# EAGLE design main (EAGLE 9.0.1)
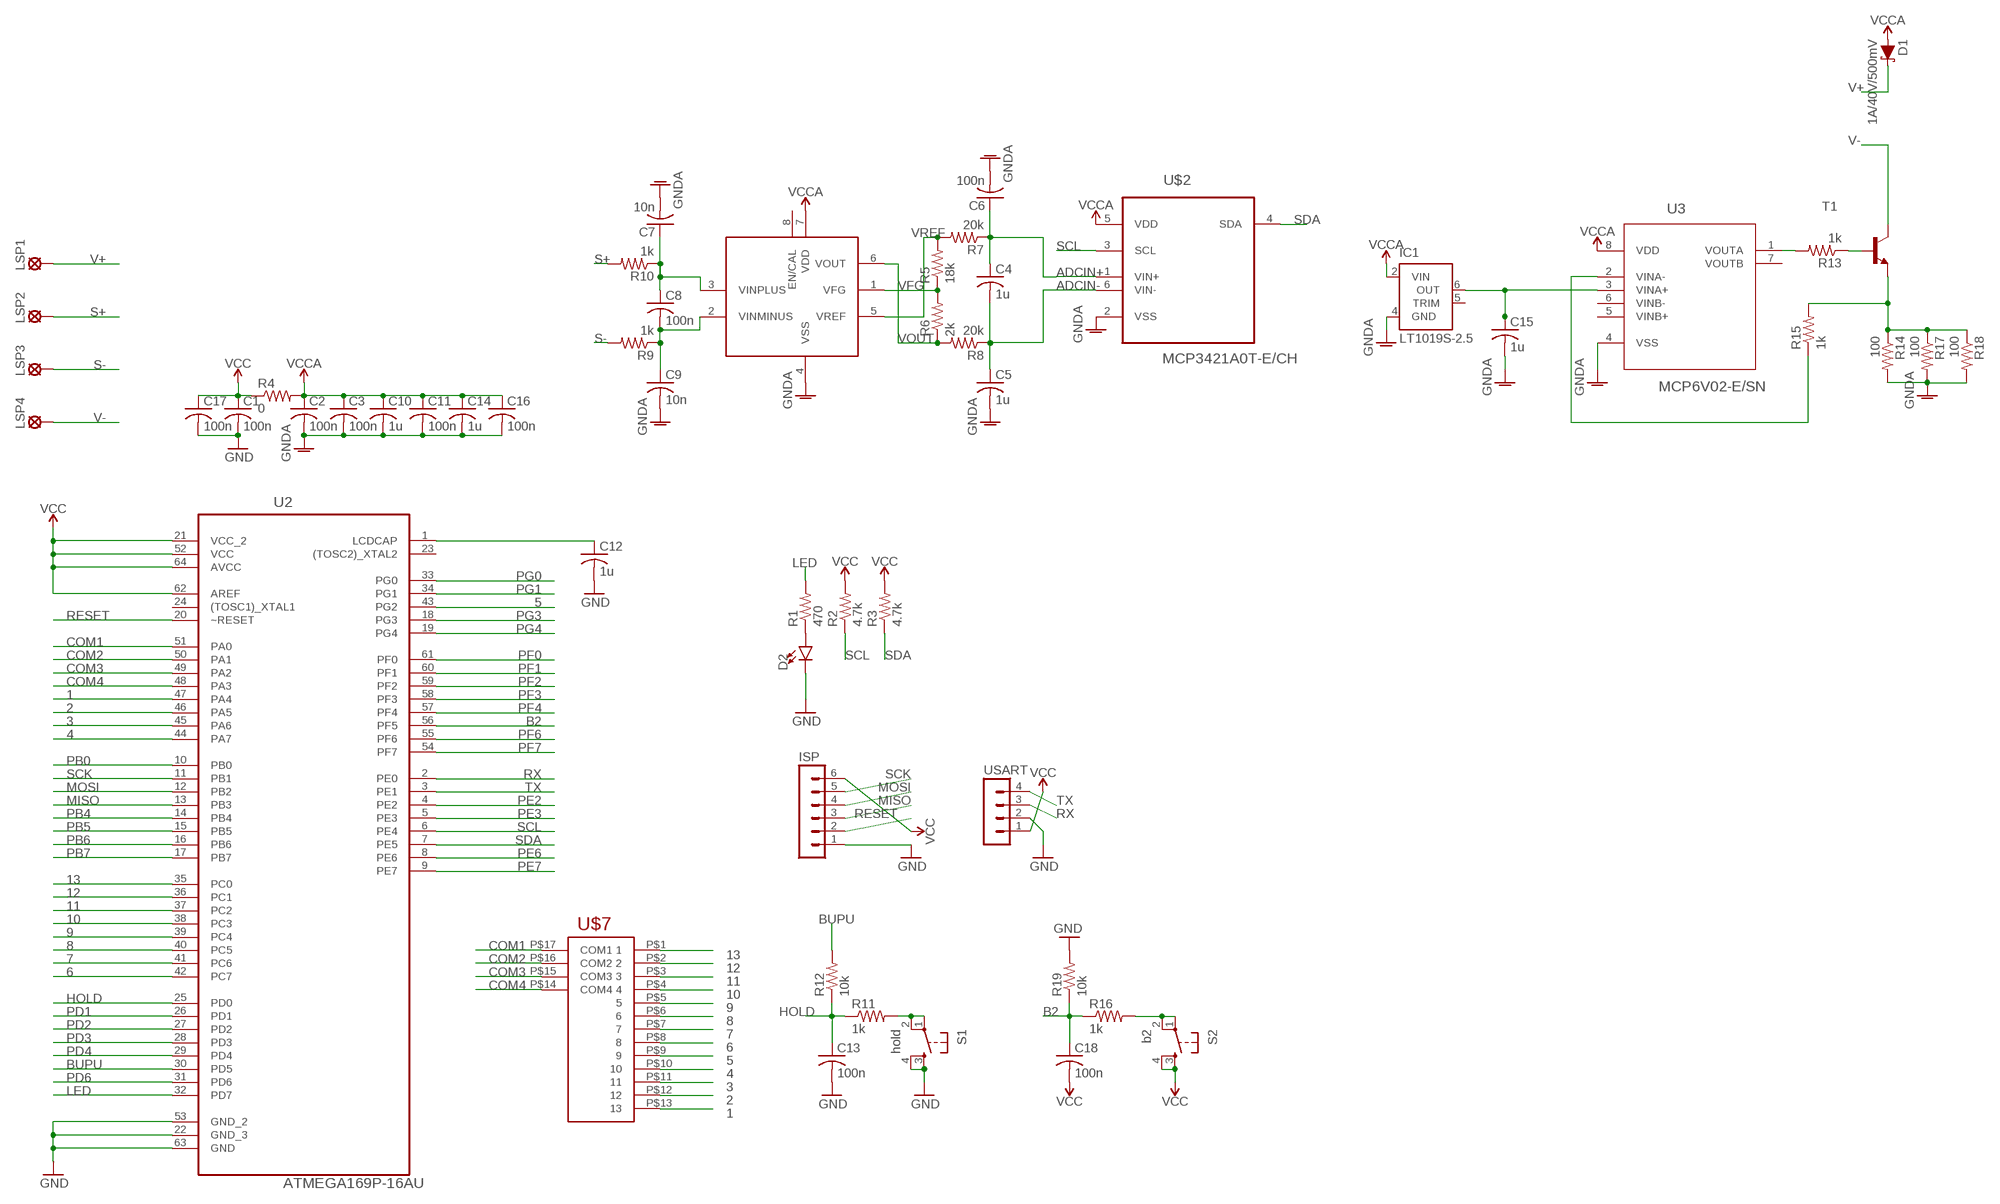
[diagram p0: schematic, sheet 1]

## Parts
C1  100n  C-USC0603  [C0603]
C2  100n  C-USC0603  [C0603]
C3  100n  C-USC0603  [C0603]
C4  1u  C-USC0603  [C0603]
C5  1u  C-USC0603  [C0603]
C6  100n  C-USC0603  [C0603]
C7  10n  C-USC0603  [C0603]
C8  100n  C-USC0603  [C0603]
C9  10n  C-USC0603  [C0603]
C10  1u  C-USC0603  [C0603]
C11  100n  C-USC0603  [C0603]
C12  1u  C-USC0603  [C0603]
C13  100n  C-USC0603  [C0603]
C14  1u  C-USC0603  [C0603]
C15  1u  C-USC0603  [C0603]
C16  100n  C-USC0603  [C0603]
C17  100n  C-USC0603  [C0603]
C18  100n  C-USC0603  [C0603]
D1  1A/40V/500mV  DIODE-SCHOTTKY-SS14  [SMA-DIODE]
D2  LED5MM  [LED_5MM]
IC1  LT1019S-2.5  [SOIC8]
ISP  MA06-1  [MA06-1]
LSP1  MCS08  [MCS08]
LSP2  MCS08  [MCS08]
LSP3  MCS08  [MCS08]
LSP4  MCS08  [MCS08]
R1  470  R-US_R0603  [R0603]
R2  4.7k  R-US_R0603  [R0603]
R3  4.7k  R-US_R0603  [R0603]
R4  0  R-US_0309/12  [0309/12]
R5  18k  R-US_R0603  [R0603]
R6  2k  R-US_R0603  [R0603]
R7  20k  R-US_R0603  [R0603]
R8  20k  R-US_R0603  [R0603]
R9  1k  R-US_R0603  [R0603]
R10  1k  R-US_R0603  [R0603]
R11  1k  R-US_R0603  [R0603]
R12  10k  R-US_R0603  [R0603]
R13  1k  R-US_R0603  [R0603]
R14  100  R-US_R0603  [R0603]
R15  1k  R-US_R0603  [R0603]
R16  1k  R-US_R0603  [R0603]
R17  100  R-US_R0603  [R0603]
R18  100  R-US_R0603  [R0603]
R19  10k  R-US_R0603  [R0603]
S1  hold  TAC_SWITCHPTH  [TACTILE-PTH]
S2  b2  TAC_SWITCHPTH  [TACTILE-PTH]
T1  MMBT3904LT1-NPN-SOT23-BEC  [SOT23-BEC]
U2  ATMEGA169P-16AU  [QFP80P1600X1600X120-64N]
U3  MCP6V02-E/SN  [SOIC127P600X175-8N]
U$2  MCP3421A0T-E/CH  [SOT95P270X145-6N]
U$3  MCP6N11  [SOIC8]
U$7  GDC0570_LCD  [GDC0570_LCD]
USART  MA04-1  [MA04-1]

## Nets
1: U2.47(PA4) U$7.P$13
2: U2.46(PA5) U$7.P$12
3: U2.45(PA6) U$7.P$11
4: U2.44(PA7) U$7.P$10
5: U2.43(PG2) U$7.P$9
6: U2.42(PC7) U$7.P$8
7: U2.41(PC6) U$7.P$7
8: U2.40(PC5) U$7.P$6
9: U2.39(PC4) U$7.P$5
10: U2.38(PC3) U$7.P$4
11: U2.37(PC2) U$7.P$3
12: U2.36(PC1) U$7.P$2
13: U2.35(PC0) U$7.P$1
ADCIN+: C4.1 C6.1 R7.1 U$2.1(VIN+)
ADCIN-: C4.2 C5.1 R8.1 U$2.6(VIN-)
B2: C18.1 R16.1 R19.1 U2.56(PF5)
BUPU: R12.2 U2.30(PD5)
COM1: U2.51(PA0) U$7.P$17(COM1)
COM2: U2.50(PA1) U$7.P$16(COM2)
COM3: U2.49(PA2) U$7.P$15(COM3)
COM4: U2.48(PA3) U$7.P$14(COM4)
GND: C1.2 C12.2 C13.2 C17.2 D2.K(C) ISP.1 R19.2 S1.3 S1.4 U2.22(GND_3) U2.53(GND_2) U2.63(GND) USART.2
GNDA: C2.2 C3.2 C5.2 C6.2 C7.2 C9.2 C10.2 C11.2 C14.2 C15.2 C16.2 IC1.4(GND) R14.2 R17.2 R18.2 U3.4(VSS) U$2.2(VSS) U$3.4(VSS)
HOLD: C13.1 R11.1 R12.1 U2.25(PD0)
LCDCAP: C12.1 U2.1(LCDCAP)
LED: R1.2 U2.32(PD7)
MISO: ISP.3 U2.13(PB3)
MOSI: ISP.4 U2.12(PB2)
N2: R16.2 S2.1 S2.2
N$2: C15.1 IC1.6(OUT) U3.3(VINA+)
N$3: R14.1 R15.2 R17.1 R18.1 T1.E
N$4: C8.2 C9.1 R9.1 U$3.2(VINMINUS)
N$5: C7.1 C8.1 R10.1 U$3.3(VINPLUS)
N$6: D2.A R1.1
N$7: R13.2 U3.1(VOUTA)
N$8: R13.1 T1.B
N$9: R15.1 U3.2(VINA-)
N$10: R11.2 S1.1 S1.2
PB0: U2.10(PB0)
PB4: U2.14(PB4)
PB5: U2.15(PB5)
PB6: U2.16(PB6)
PB7: U2.17(PB7)
PD1: U2.26(PD1)
PD2: U2.27(PD2)
PD3: U2.28(PD3)
PD4: U2.29(PD4)
PD6: U2.31(PD6)
PE2: U2.4(PE2)
PE3: U2.5(PE3)
PE6: U2.8(PE6)
PE7: U2.9(PE7)
PF0: U2.61(PF0)
PF1: U2.60(PF1)
PF2: U2.59(PF2)
PF3: U2.58(PF3)
PF4: U2.57(PF4)
PF6: U2.55(PF6)
PF7: U2.54(PF7)
PG0: U2.33(PG0)
PG1: U2.34(PG1)
PG3: U2.18(PG3)
PG4: U2.19(PG4)
RESET: ISP.2 U2.20(~RESET)
RX: U2.2(PE0) USART.3
S+: LSP2.MP R10.2
S-: LSP3.MP R9.2
SCK: ISP.5 U2.11(PB1)
SCL: R2.1 U2.6(PE4) U$2.3(SCL)
SDA: R3.1 U2.7(PE5) U$2.4(SDA)
TX: U2.3(PE1) USART.4
V+: D1.C LSP1.MP
V-: LSP4.MP T1.C
VCC: C1.1 C17.1 C18.2 ISP.6 R2.2 R3.2 R4.1 S2.3 S2.4 U2.21(VCC_2) U2.52(VCC) U2.62(AREF) U2.64(AVCC) USART.1
VCCA: C2.1 C3.1 C10.1 C11.1 C14.1 C16.1 D1.A IC1.2(VIN) R4.2 U3.8(VDD) U$2.5(VDD) U$3.7(VDD)
VFG: R5.1 R6.2 U$3.1(VFG)
VOUT: R6.1 R8.2 U$3.6(VOUT)
VREF: R5.2 R7.2 U$3.5(VREF)
Unconnected: IC1.5(TRIM) U2.23((TOSC2)_XTAL2) U2.24((TOSC1)_XTAL1) U3.5(VINB+) U3.6(VINB-) U3.7(VOUTB) U$3.8(EN/CAL)

## Library data of the parts
C1-C18 = rcl:C-US: CAPACITOR, American symbol; SPICEPREFIX: C
D1 = SparkFun-DiscreteSemi:DIODE-SCHOTTKY: Schottky diode A Schottky diode is a semiconductor diode which has a low forward voltage drop and a very fast switching action.; PROD_ID: DIO-08053
D2 = SparkFun-LED:LED: LED (Generic) Standard schematic elements and footprints for 5mm, 3mm, 1206, and 0603 sized LEDs. Generic LEDs with no color specified.
IC1 = linear-technology:LT1019?*: Precision Voltage Reference Source: http://www.linear.com/pc/downloadDocument.do?navId=H0,C1,C1154,C1002,C1243,P1130,D3834; MPN: LT1019CS8-2.5#PBF; OC_FARNELL: 9559426; OC_NEWARK: 57M0929
ISP = con-lstb:MA06-1: PIN HEADER; OC_FARNELL: unknown; OC_NEWARK: unknown
LSP1-LSP4 = solpad:MCS08: SOLDER PAD MC S0,8, drill 1.2 mm, distributor Buerklin, 08F130
R1-R19 = rcl:R-US_: RESISTOR, American symbol; SPICEPREFIX: R
S1 S2 = SparkFun-Retired:TAC_SWITCH: Momentary Switch Button commonly used for reset or general input. Spark Fun Electronics SKU : COM-00097 SMT- SWCH-08247
T1 = DC_LOAD_AU:*-NPN-: NPN Transistror BF959 corrected 2008.03.06
U2 = 7_segment_lib:ATMEGA169P-16AU: 8-bit Microcontroller with 16K Bytes In-System Programmable Flash; MPN: ATMEGA169P-16AU; OC_FARNELL: 1675975; OC_NEWARK: 33P6478; PACKAGE: TQFP-64; SUPPLIER: Atmel
U3 = Microchip_By_element14_Batch_1:MCP6V02-E/SN: Auto-Zeroed Op Amps; MPN: MCP6V02-E/SN; OC_FARNELL: 1629346; OC_NEWARK: 27M0220; PACKAGE: SOIC-8; SUPPLIER: Microchip
U$2 = Microchip_By_element14_Batch_1:MCP3421A0T-E/CH: Analog-to-Digital Converter; MPN: MCP3421A0T-E/CH; OC_FARNELL: 1605567; OC_NEWARK: 77M2561; PACKAGE: SOT-6; SUPPLIER: Microchip
U$3 = 7_segment_lib:MCP6N11
U$7 = 7_segment_lib:GDC0570_LCD
USART = con-lstb:MA04-1: PIN HEADER; OC_FARNELL: unknown; OC_NEWARK: unknown

## Board
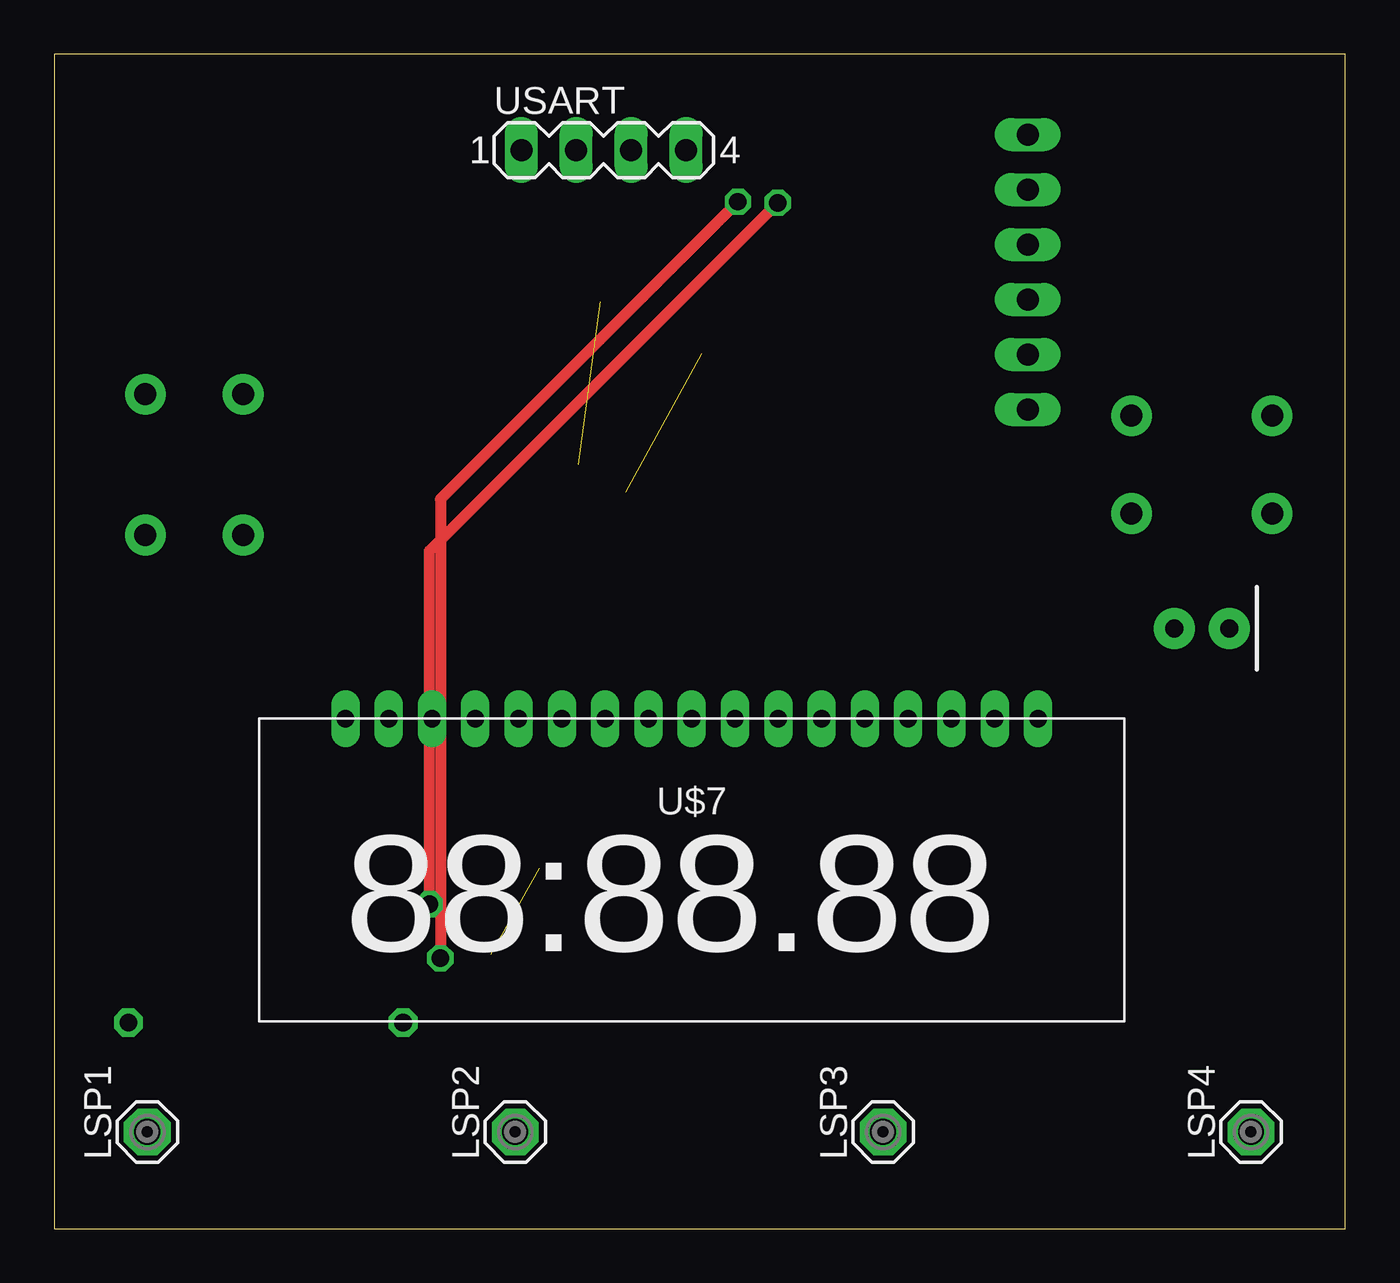
[diagram p1: board, top side]
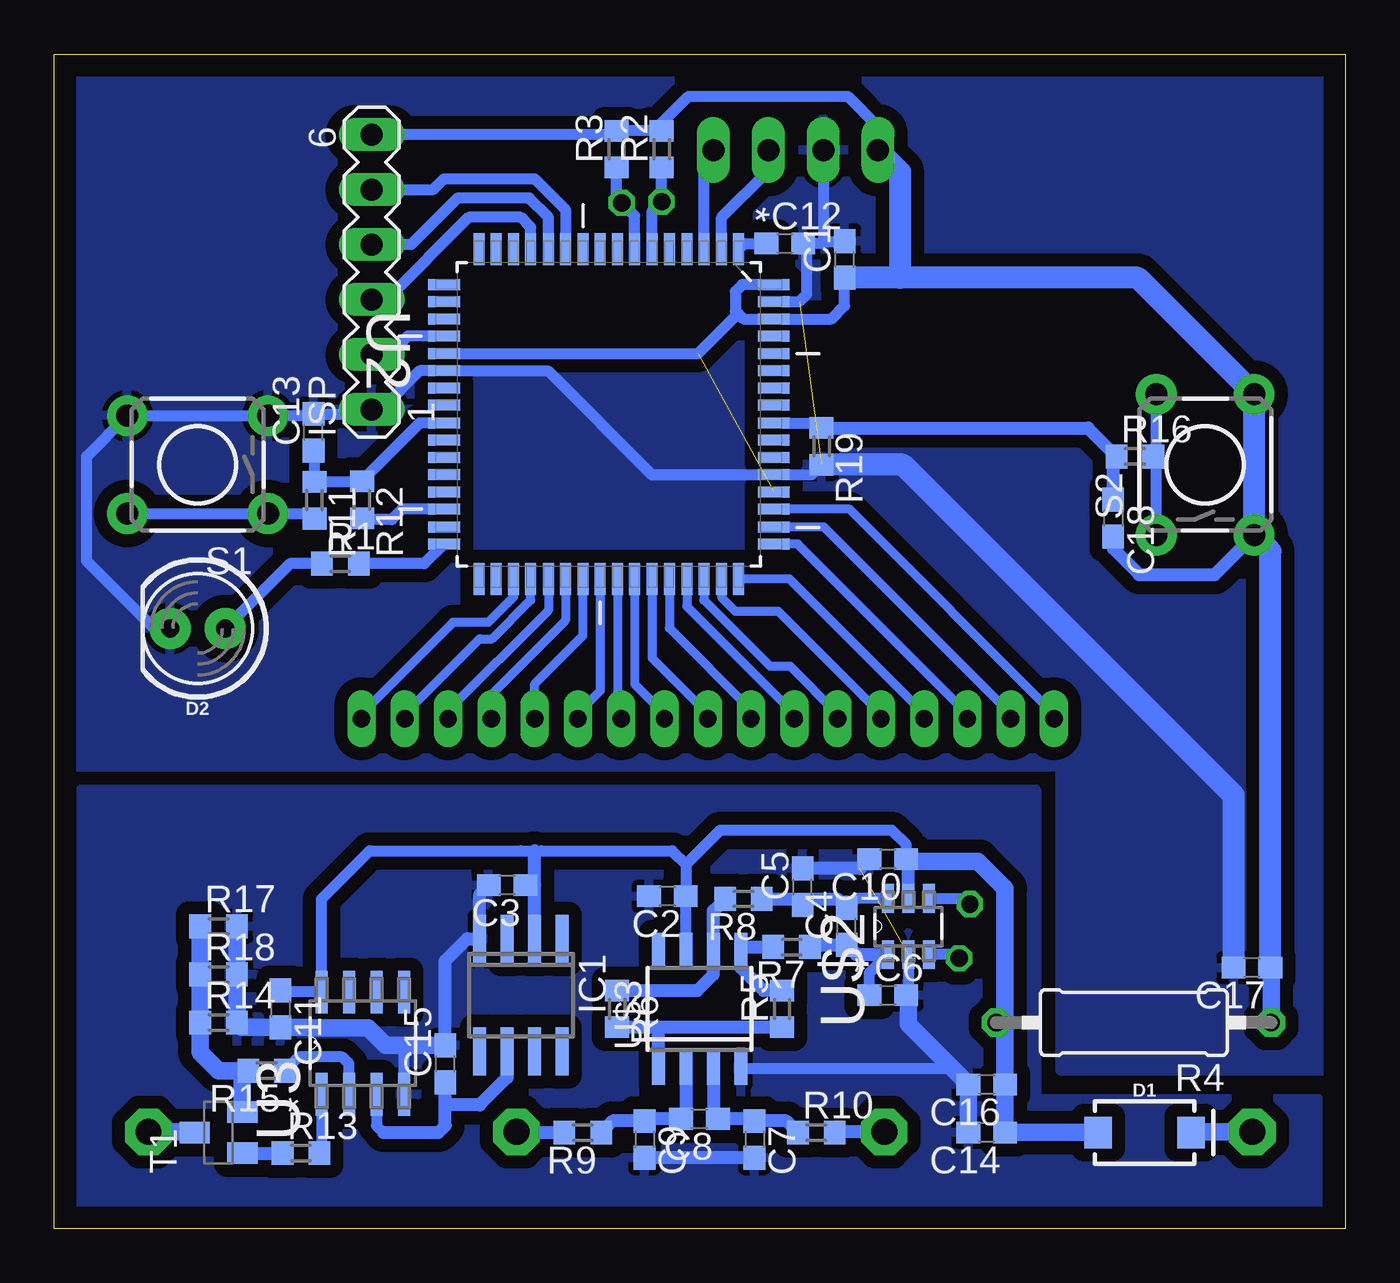
[diagram p2: board, bottom side, seen from below]

Size 59.67 x 54.28 mm. Coordinates in mm from the lower left corner, seen from the top.
Outline: 0,0 59.67,0 59.67,54.28 0,54.28 0,0
Copper layers (1*16): Top 0.035mm / dielectric 1.5mm / Bottom 0.035mm
Design rules "default *": minimum track width 16mil, minimum drill 0.35mm, track to track 10mil, track to pad 10mil, pad to pad 10mil, via to via 10mil, smd to smd 10mil, copper to edge 40mil, drill to drill 6mil, minimum pad ring 10mil, minimum via ring 8mil, stop-mask expansion 4mil, vias tented up to drill 0mil, thermal gap 10mil

### Footprints (pad centres in the part's own frame; a part is rotated, then mirrored left to right if it is on the bottom)
C0603 = smd 1.1 x 1: 1 -0.85,0; 2 0.85,0
SMA-DIODE = smd 1.27 x 1.47: A -2.15,0; C 2.15,0
LED_5MM = drill 0.813 pad 1.88: A -1.27,0; K 1.27,0
SOIC8 = smd 0.6 x 2.2: 1 -1.905,-2.6; 2 -0.635,-2.6; 3 0.635,-2.6; 4 1.905,-2.6; 5 1.905,2.6; 6 0.635,2.6; 7 -0.635,2.6; 8 -1.905,2.6
MA06-1 = drill 1.016 long: 1 -6.35,0; 2 -3.81,0; 3 -1.27,0; 4 1.27,0; 5 3.81,0; 6 6.35,0
MCS08 = drill 1.194 pad 2.159 octagon: MP 0,0
R0603 = smd 1 x 1.1: 1 -0.85,0; 2 0.85,0
0309/12 = drill 0.813 octagon: 1 -6.35,0; 2 6.35,0
TACTILE-PTH = drill 1.016 pad 1.88: 1 -3.251,2.261; 2 3.251,2.261; 3 -3.251,-2.261; 4 3.251,-2.261
SOT23-BEC = smd 1 x 1.4: B -0.95,-1.1; C 0,1.1; E 0.95,-1.1
QFP80P1600X1600X120-64N = smd 1.473 x 0.508: 1 -7.62,5.994; 2 -7.62,5.207; 3 -7.62,4.394; 4 -7.62,3.607; 5 -7.62,2.794; 6 -7.62,2.007; 7 -7.62,1.194; 8 -7.62,0.406; 9 -7.62,-0.406; 10 -7.62,-1.194; 11 -7.62,-2.007; 12 -7.62,-2.794; 13 -7.62,-3.607; 14 -7.62,-4.394; 15 -7.62,-5.207; 16 -7.62,-5.994; 33 7.62,-5.994; 34 7.62,-5.207; 35 7.62,-4.394; 36 7.62,-3.607; 37 7.62,-2.794; 38 7.62,-2.007; 39 7.62,-1.194; 40 7.62,-0.406; 41 7.62,0.406; 42 7.62,1.194; 43 7.62,2.007; 44 7.62,2.794; 45 7.62,3.607; 46 7.62,4.394; 47 7.62,5.207; 48 7.62,5.994 | smd 0.508 x 1.473: 17 -5.994,-7.62; 18 -5.207,-7.62; 19 -4.394,-7.62; 20 -3.607,-7.62; 21 -2.794,-7.62; 22 -2.007,-7.62; 23 -1.194,-7.62; 24 -0.406,-7.62; 25 0.406,-7.62; 26 1.194,-7.62; 27 2.007,-7.62; 28 2.794,-7.62; 29 3.607,-7.62; 30 4.394,-7.62; 31 5.207,-7.62; 32 5.994,-7.62; 49 5.994,7.62; 50 5.207,7.62; 51 4.394,7.62; 52 3.607,7.62; 53 2.794,7.62; 54 2.007,7.62; 55 1.194,7.62; 56 0.406,7.62; 57 -0.406,7.62; 58 -1.194,7.62; 59 -2.007,7.62; 60 -2.794,7.62; 61 -3.607,7.62; 62 -4.394,7.62; 63 -5.207,7.62; 64 -5.994,7.62
SOIC127P600X175-8N = smd 1.981 x 0.559: 1 -2.362,1.905; 2 -2.362,0.635; 3 -2.362,-0.635; 4 -2.362,-1.905; 5 2.362,-1.905; 6 2.362,-0.635; 7 2.362,0.635; 8 2.362,1.905
SOT95P270X145-6N = smd 1.321 x 0.559: 1 -1.295,0.94; 2 -1.295,0; 3 -1.295,-0.94; 4 1.295,-0.94; 5 1.295,0; 6 1.295,0.94
SOIC8' = smd 0.6 x 1.5: 1 -1.905,-2.75; 2 -0.635,-2.75; 3 0.635,-2.75; 4 1.905,-2.75; 5 1.905,2.75; 6 0.635,2.75; 7 -0.635,2.75; 8 -1.905,2.75
GDC0570_LCD = drill 0.8 long: P$1 -16,0; P$2 -14,0; P$3 -12,0; P$4 -10,0; P$5 -8,0; P$6 -6,0; P$7 -4,0; P$8 -2,0; P$9 0,0; P$10 2,0; P$11 4,0; P$12 6,0; P$13 8,0; P$14 10,0; P$15 12,0; P$16 14,0; P$17 16,0
MA04-1 = drill 1.016 long: 1 -3.81,0; 2 -1.27,0; 3 1.27,0; 4 3.81,0

### Placement (x,y rotation side)
C1  23.14,44.79 90 bottom
C2  31.33,15.37 180 bottom
C3  38.73,15.88 180 bottom
C4  23.05,13.97 90 bottom
C5  25.08,15.8 90 bottom
C6  21.15,10.79 0 bottom
C7  27.3,4.13 270 bottom
C8  29.84,5.08 180 bottom
C9  32.38,4.13 270 bottom
C10  21.15,17.08 180 bottom
C11  49.21,10.16 270 bottom
C12  25.91,45.53 0 bottom
C13  47.68,36.8 90 bottom
C14  16.57,4.45 180 bottom
C15  41.59,7.62 90 bottom
C16  16.57,6.67 180 bottom
C17  4.32,12.06 180 bottom
C18  10.73,32.84 270 bottom
D1  9.27,4.45 0 bottom
D2  53.04,27.74 180 bottom
IC1  38.1,10.79 180 bottom
ISP  44.99,44.21 90 bottom
LSP1  4.31,4.47 90 top
LSP2  21.31,4.47 90 top
LSP3  38.31,4.47 90 top
LSP4  55.31,4.47 90 top
R1  46.44,30.73 0 bottom
R2  31.6,49.89 90 bottom
R3  33.68,49.89 90 bottom
R4  9.78,9.53 180 bottom
R5  26.03,10.16 90 bottom
R6  33.66,10.16 270 bottom
R7  25.59,13.02 180 bottom
R8  27.81,15.24 180 bottom
R9  35.24,4.45 180 bottom
R10  24.45,4.45 0 bottom
R11  47.64,33.67 270 bottom
R12  45.44,33.68 270 bottom
R13  48.26,3.49 0 bottom
R14  52.07,9.53 0 bottom
R15  49.85,7.3 180 bottom
R16  9.73,35.69 0 bottom
R17  52.07,13.97 0 bottom
R18  52.07,11.75 0 bottom
R19  24.21,36.16 270 bottom
S1  53.04,35.31 180 bottom
S2  6.48,35.31 90 bottom
T1  52.07,4.45 90 bottom
U2  34.04,37.64 270 bottom
U3  45.4,8.57 90 bottom
U$2  20.19,13.97 90 bottom
U$3  MCP6N11  [SOIC8']  29.84,10.16 0 bottom
U$7  29.46,23.57 180 top
USART  25.4,49.85 0 top

### Tracks (layer width: path | path; a pad name or v marks a point on that pad's centre or on a via)
1
  Bottom 0.406: U2.47 28.83,29.17 28.2,28.54 26.21,28.54 21.46,23.8 U$7.P$13
2
  Bottom 0.406: U2.46 29.64,29.05 26.59,26 25.66,26 23.46,23.8 U$7.P$12
3
  Bottom 0.406: U2.45 30.43,28.76 25.46,23.8 U$7.P$11
4
  Bottom 0.406: U2.44 31.24,27.75 27.46,23.98 U$7.P$10
5
  Bottom 0.406: U2.43 32.03,26.36 29.46,23.8 U$7.P$9
6
  Bottom 0.406: U2.42 32.84,25.18 31.46,23.8 U$7.P$8
7
  Bottom 0.406: U2.41 33.63,23.74 U$7.P$7
8
  Bottom 0.406: U2.40 34.44,24.85 35.73,23.57 U$7.P$6
9
  Bottom 0.406: U$7.P$5 37.46,25.17 35.23,27.41 U2.39
10
  Bottom 0.406: U2.38 36.04,28.11 39.46,24.69 U$7.P$4
11
  Bottom 0.406: U2.37 36.83,28.57 41.46,23.94 U$7.P$3
12
  Bottom 0.406: U$7.P$2 43.46,23.8 40,27.26 39.43,27.26 37.64,29.05 U2.36
13
  Bottom 0.406: U2.35 38.43,29.2 39.61,28.02 41.24,28.02 45.46,23.8 U$7.P$1
ADCIN+
  Bottom 0.508: C6.1 22,11.81 U$2.1
  Bottom 0.61: R7.1 24.64,13.12 C4.1 22.6,12.68 U$2.1
ADCIN-
  Bottom 0.508: 21.16,15.24 U$2.6 22.6,15.27 C4.2
  Bottom 0.61: R8.1 25.08,15.24 | 25.08,15.24 23.47,15.24 C4.2 | C5.1 25.08,15.24
B2
  Bottom 0.508: U2.56 24.44,37.24 R19.1
  Bottom 0.61: C18.1 10.73,35.53 R16.1 11.9,37.01 R19.1
BUPU
  Bottom 0.508: U2.30 43.59,33.25 44.07,32.77 45.38,32.77 R12.2
COM1
  Bottom 0.406: U$7.P$17 13.46,23.8 22.92,33.25 U2.51
COM2
  Bottom 0.406: U$7.P$16 15.46,23.8 24.1,32.44 U2.50
COM3
  Bottom 0.406: U$7.P$15 17.46,23.8 25.32,31.65 U2.49
COM4
  Bottom 0.406: U$7.P$14 19.46,23.8 25.69,30.02 U2.48
GND  (1 unrouted)
  Bottom 0.508: USART.2 24.13,45.59 | 24.13,45.59 24.19,45.53 24.64,45.53 | 24.64,45.53 C12.2 | C1.2 23.19,45.59 24.13,45.59 | U2.63 25.22,42.85 24.89,43.18 24.89,45.28 24.64,45.53 | D2.K 55.04,27.74 58.17,30.86 58.17,35.69 S1.4 S1.3 47.76,37.57 C13.2 45.2,37.66 ISP.1 44.56,37.86 42.77,39.65 U2.22 36.85,39.65 32.05,34.85 U2.53 24.66,34.85 R19.2
  Bottom 1.016: C17.2 5.17,20.03 20.45,35.31 R19.2
  pour Bottom (isolate 0.61): 0,54.36 59.69,54.36 59.69,21.34 13.21,21.34 13.21,7.3 0,7.3
GNDA  (1 unrouted)
  Bottom 0.508: C6.2 20.19,10.9 U$2.2 | U$3.4 18.17,7.41 C16.2 | U3.4 43.5,8.47
  Bottom 0.61: C7.2 C9.2 | C10.2 22.43,16.65 C5.2 | C15.2 41.59,12.38 40.58,13.39 IC1.4 40.01,15.46 C3.2
  Bottom 0.813: R17.2 R18.2 R14.2 51.01,9.31 C11.2 47.89,9.31 47.86,9.28 45.16,9.28 44.35,8.47 43.5,8.47 C15.2 | C14.2 C16.2 20.19,9.44 20.19,10.9
  pour Bottom (isolate 0.61): 1.27,0 58.42,0 58.42,20.32 14.29,20.32 14.29,6.03 1.27,6.03
HOLD
  Bottom 0.508: C13.1 47.64,35.92 R11.1 45.45,34.52 R12.1 45.44,34.57 42.77,37.24 U2.25
LCDCAP
  Bottom 0.508: U2.1 27.77,45.53 C12.1
LED
  Bottom 0.508: U2.32 42.57,30.73 R1.2
MISO
  Bottom 0.508: U2.13 37.64,46.28 38.1,46.74 40.51,46.74 44.31,42.94 ISP.3
MOSI
  Bottom 0.508: U2.12 36.83,46.74 37.72,47.62 41.02,47.62 43.16,45.48 ISP.4
N2
  Bottom 0.508: S2.1 8.74,35.69 | 8.74,35.69 S2.2 | R16.2 8.74,35.69
N$2
  Bottom 0.508: U3.3 44.77,4.76 44.45,4.45
  Bottom 0.61: 44.45,4.45 41.91,4.45 41.59,4.76 41.59,5.71 | 41.59,5.71 41.59,6.03 C15.1 | IC1.6 38.73,6.99 40.01,5.71 41.59,5.71
N$3
  Bottom 0.813: R17.1 R18.1 R14.1 52.92,8.15 52.07,7.3 R15.2 50.97,7.03 T1.E
N$4
  Bottom 0.61: U$3.2 30.48,5.29 C8.2 32.6,5.08 C9.1 33.86,4.98 R9.1
N$5
  Bottom 0.61: U$3.3 29.21,5.29 C8.1 27.41,5.08 C7.1 25.83,4.98 R10.1
N$6
  Bottom 0.508: R1.1 48.77,30.73 D2.A
N$7
  Bottom 0.508: U3.1 47.31,3.6 R13.2
N$8
  Bottom 0.61: T1.B R13.1
N$9
  Bottom 0.508: U3.2 46.04,7.62 46.36,7.94 48.36,7.94 R15.1
N$10
  Bottom 0.508: S1.2 S1.1 47.87,33.05 R11.2
RESET
  Bottom 0.508: U2.20 43.33,41.25 44.2,40.39 44.98,40.39 ISP.2
RX
  Bottom 0.508: U2.2 28.83,46.74 26.67,48.9 USART.3
S+
  Bottom 0.61: LSP2.MP 23.57,4.47 R10.2
S-
  Bottom 0.61: LSP3.MP 38.28,4.45 R9.2
SCK
  Bottom 0.508: ISP.5 42.15,48.02 41.66,48.51 37.46,48.51 36.04,47.09 U2.11
SCL  (via drill 0.8)
  Top 0.508: v31.6,47.46 17.85,33.71 v17.85,12.5
  Bottom 0.508: U2.6 32.03,47.03 v31.6,47.46 R2.1 | v17.85,12.5 18.02,12.68 U$2.3
SDA  (via drill 0.8)
  Top 0.508: v17.35,15 17.35,31.32 v33.44,47.41
  Bottom 0.508: U2.7 32.84,46.81 v33.44,47.41 33.68,47.65 R3.1 | U$2.4 17.62,15.27 v17.35,15
TX
  Bottom 0.508: U2.3 29.64,49.42 USART.4
V+
  Bottom 0.813: LSP1.MP 7.1,4.47 D1.C
V-
  Bottom 0.813: LSP4.MP 53.2,4.47 T1.C
VCC  (1 unrouted)
  Bottom 0.508: 26.44,42.01 U2.62 | ISP.6 33.85,50.56 R3.2 R2.2 31.6,51.08 30.35,52.32 22.99,52.32 21.59,50.93 USART.1 | U2.62 23.75,42.04 23.14,42.65 C1.1 | U2.64 27.86,43.64 28.19,43.31 28.19,42.42 28.07,42.29 | 28.07,42.29 27.81,42.04 U2.62 | U2.21 29.92,40.44 28.07,42.29
  Bottom 0.61: C18.2 10.73,31.43 9.52,30.23 6.04,30.23 S2.3
  Bottom 0.813: R4.1 3.43,12.03 C17.1
  Bottom 1.016: C17.1 3.47,31.31 S2.3 S2.4 9.6,43.94 20.57,43.94 | 20.57,43.94 C1.1 | USART.1 20.57,48.83 20.57,43.94
VCCA
  Bottom 0.508: U$3.7 C2.1 | C2.1 | C11.1 49.14,10.94 U3.8 47.31,15.24 45.09,17.46 38.1,17.46 37.46,17.46 37.15,17.46 31.12,17.46 30.48,16.83 | 30.48,16.83 C2.1 | C10.1 20.3,17.76 20.95,18.41 28.89,18.41 30.48,16.83
  Bottom 0.61: U$2.5 20.19,16.98 C10.1 | IC1.2 37.46,15.88 | 37.46,15.88 37.46,17.46 | C3.1 37.46,15.88
  Bottom 0.813: D1.A C14.1 C16.1 15.72,9.12 | R4.2 15.72,9.12 | 15.72,9.12 15.72,15.72 16.98,16.98 20.19,16.98
VFG
  Bottom 0.61: R5.1 31.75,9.31 | 31.75,9.31 R6.2 | U$3.1 31.75,9.31
VOUT
  Bottom 0.61: R6.1 29.95,11.01 29.21,11.75 U$3.6 29.21,14.69 R8.2
VREF
  Bottom 0.61: R5.2 26.88,11.01 27.46,11.59 27.94,12.06 U$3.5 27.83,13.02 R7.2